# Altium schematic sheet IMU-BMI160.SchDoc
size A; SheetNumber: 12; SheetTotal: 15
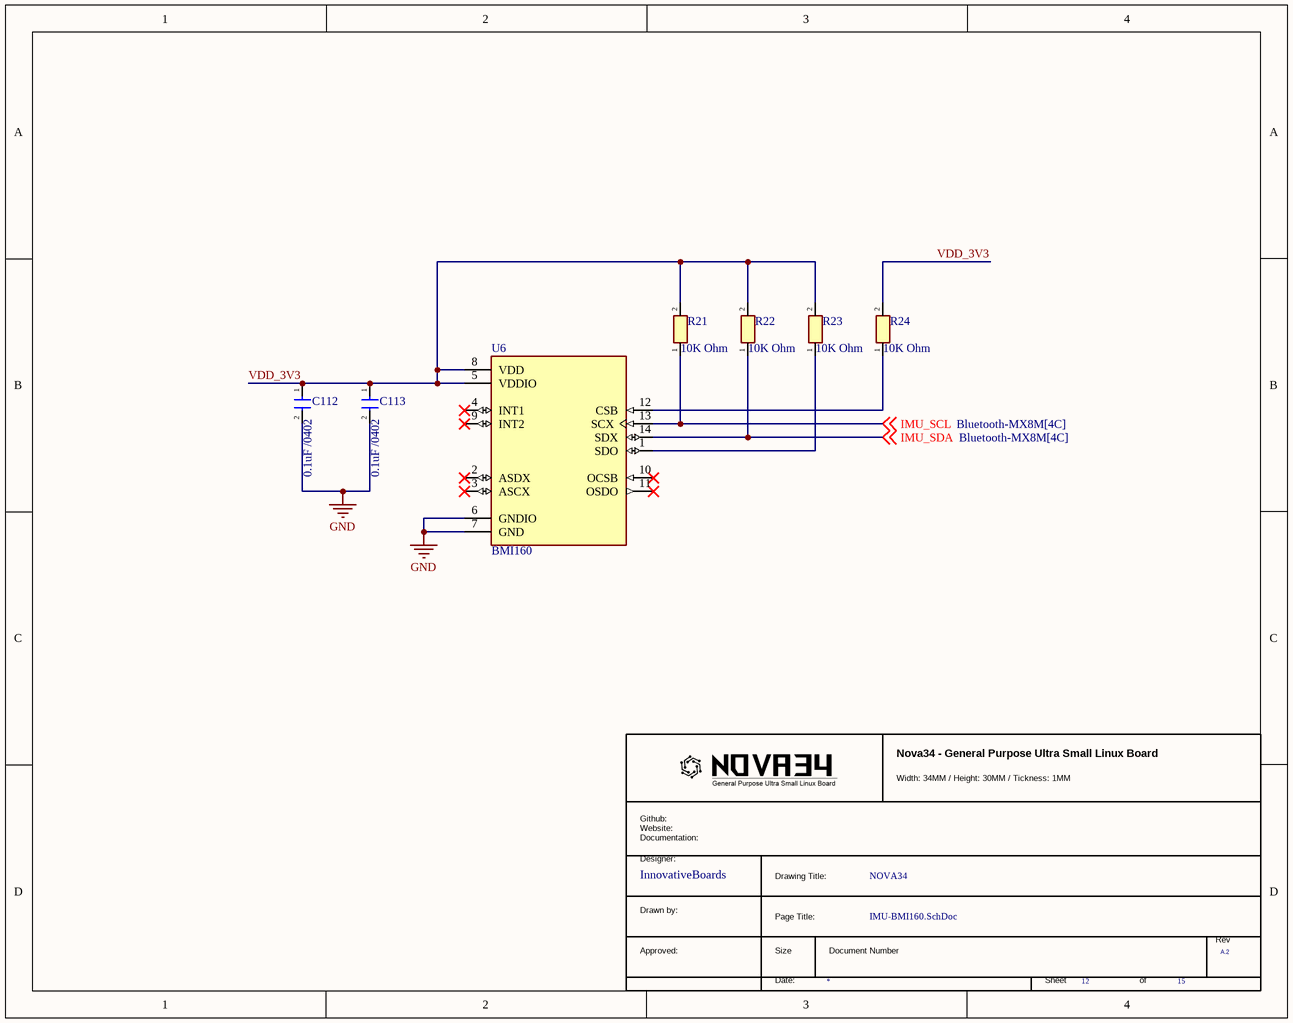
[diagram p0: IMU-BMI160.SchDoc]

## Parts
*  RevCode: A.2  (hidden comment: TitleBlock_MCPG)  (graphical)
C112  0.1uF /0402  [CAPC1005X70N]
C113  0.1uF /0402  [CAPC1005X70N]
R21  10K Ohm  [RESC1005X40N]
R22  10K Ohm  [RESC1005X40N]
R23  10K Ohm  [RESC1005X40N]
R24  10K Ohm  [RESC1005X40N]
U6  BMI160  [PQFN50P250X300X88-14N]

## Nets
GND: C112.2 C113.2 U6.6(GNDIO) U6.7(GND)
IMU_SCL: R21.1 U6.13(SCX) ; off-sheet IMU_SCL
IMU_SDA: R22.1 U6.14(SDX) ; off-sheet IMU_SDA
VDD_3V3: C112.1 C113.1 R21.2 R22.2 R23.2 R24.2 U6.5(VDDIO) U6.8(VDD)
NetR23_1: R23.1 U6.1(SDO)
NetR24_1: R24.1 U6.12(CSB)

Not connected (* = marked no-connect by the designer): U6 2(ASDX)* 3(ASCX)* 4(INT1)* 9(INT2)* 10(OCSB)* 11(OSDO)*

## Notes on the sheet
- (in symbol TitleBlock_MCPG) Nova34 - General Purpose Ultra Small Linux Board; Width: 34MM / Height: 30MM / Tickness: 1MM; Github: / Website: / Documentation:; Designer:; InnovativeBoards; Drawing Title:; NOVA34; Drawn by:; Page Title:; Rev; Approved:; Size; Document Number; Date:; Sheet; of

## Library data of the parts
C112 C113 = GRM155R71C104KA88D: Capacitor; Manufacturer_Name: Murata Electronics; Datasheet Link: https://search.murata.co.jp/Ceramy/image/img/A01X/G101/ENG/GRM155R71C104KA88-01A.pdf; Height: 0.7mm; Manufacturer_Part_Number: GRM155R71C104KA88D; Mouser Part Number: N/A; Arrow Part Number: GRM155R71C104KA88D; Arrow Price/Stock: https://www.arrow.com/en/products/grm155r71c104ka88d/murata-manufacturing?utm_currency=USD&region=nac
R21-R24 = RC0402FR-0710KL: Resistor; Manufacturer_Name: KEMET; Datasheet Link: http://www.yageo.com/documents/recent/PYu-RC0402_51_RoHS_L_6_r.pdf; Height: 0.4mm; Manufacturer_Part_Number: RC0402FR-0710KL; Mouser Part Number: 603-RC0402FR-0710KL; Mouser Price/Stock: https://www.mouser.co.uk/ProductDetail/YAGEO/RC0402FR-0710KL?qs=I1mnnYJTTsxUoNwrUsQExA%3D%3D; Arrow Part Number: RC0402FR-0710KL; Arrow Price/Stock: https://www.arrow.com/en/products/rc0402fr-0710kl/yageo?region=europe
U6 = BMI160: Accelerometer, Gyroscope, 6 Axis Sensor IÂ²C, SPI Output; Package: None; Price: None; Availability: Unavailable; MP: BMI160; Value: *
* = TitleBlock_MCPG: Page Create Date: March  8, 1995